# EasyEDA Pro project ProProject_基于STM32的Buck-Boost型数字电源_2024-06-04.epro, board PCB3
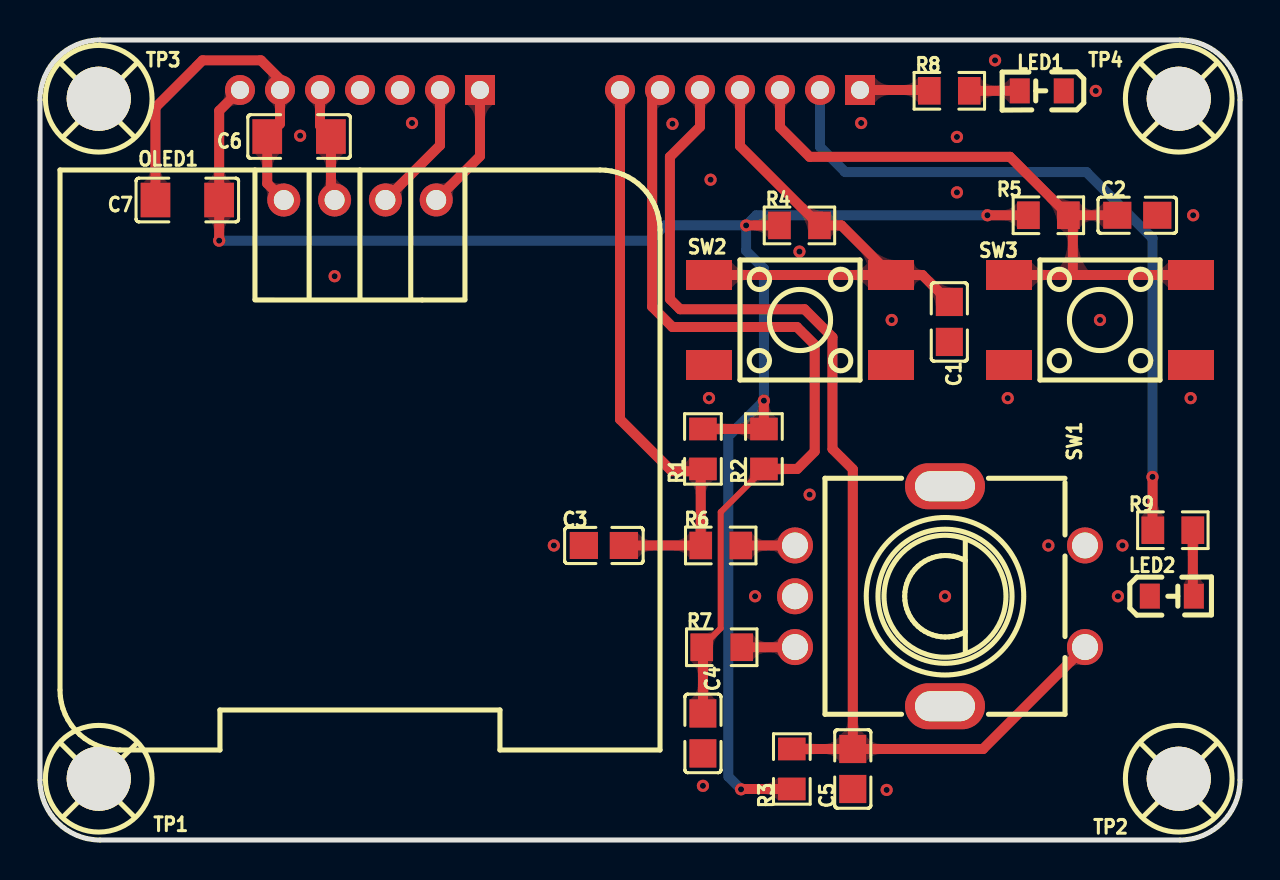
[diagram p11: board, top side]
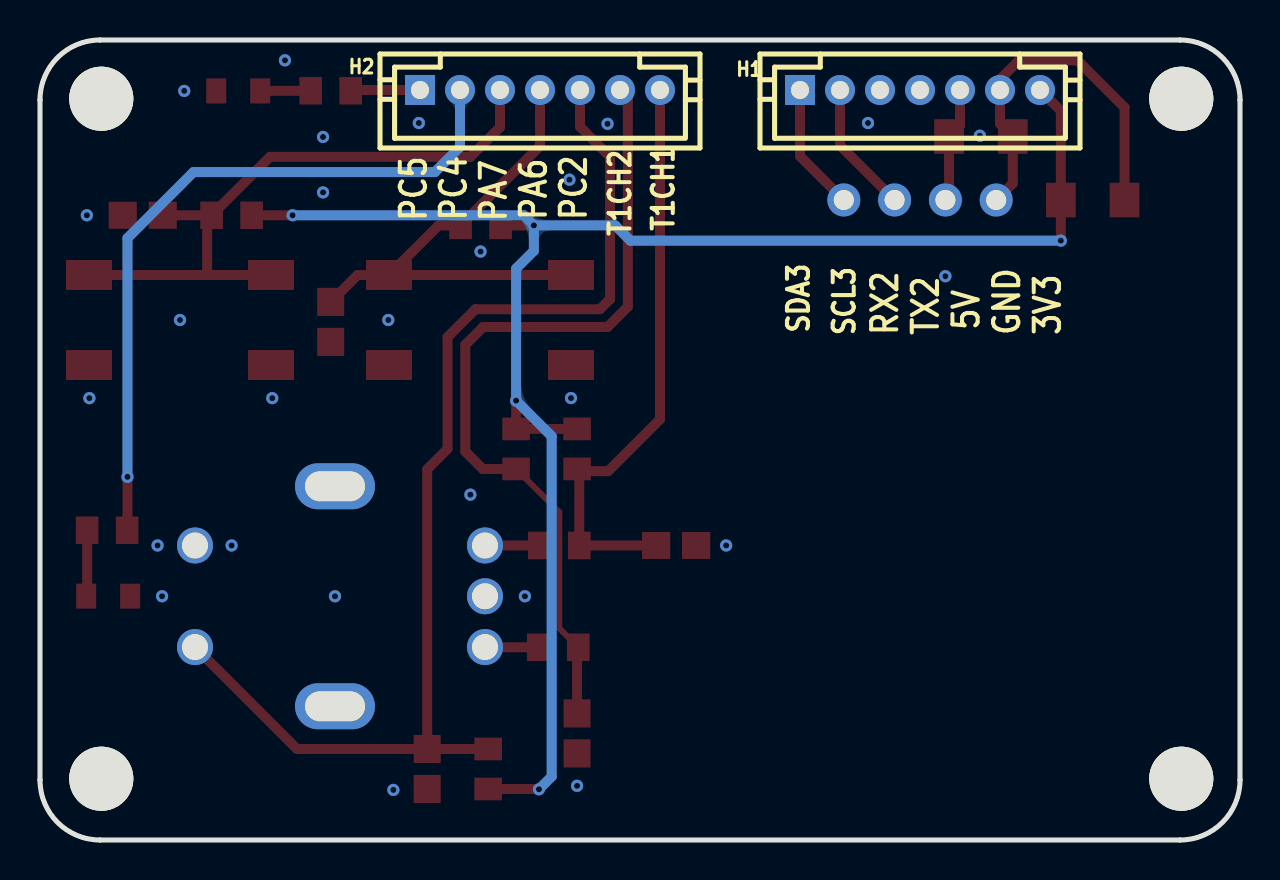
[diagram p12: board, bottom side, seen from below]

Outline 60 x 40 mm; copper layers: Top Layer, Bottom Layer. Coordinates in mm from the lower left corner of the outline.
Outline path: 0,37 0,3 arc(0.88,0.88) 3,0 57,0 arc(59.12,0.88) 60,3 60,37 arc(59.12,39.12) 57,40 3,40 arc(0.88,39.12) 0,37
Stack: Top Layer 0.035mm / Dielectric1 1.51mm FR4 er 4.5 / Bottom Layer 0.035mm

## Design rules (mm)
template: 自定义配置
spacing copperThickness1oz (default): track to track 0.102, other pairs 0.152 to 0.3
spacing copperThickness2oz: track to track 0.203, other pairs 0.152 to 0.3
track width copperThickness1oz (default): min 0.127, default 0.254, max 2.54
track width copperThickness2oz: min 0.203, default 0.254, max 2.54
differential pair differentialPair (default): width min 0.127, default 0.254, max 2.54; gap min 0.152, default 0.152
via viaSize (default): diameter min 0.5, default 0.61, max 10; hole min 0.3, default 0.305, max 6.3

## Placement (name value [footprint] x y rotation side)
C1  100nF  [C0805]  45.47 25.9 270 top
C2  100nF  [C0805]  54.86 31.24 0 top
C3  100nF  [C0805]  28.19 14.73 0 top
C4  100nF  [C0805]  33.15 5.33 90 top
C5  12nF  [C0805]  40.64 3.55 90 top
C6  10uF  [C1206]  12.95 35.17 0 top
C7  10uF  [C1206]  7.37 32 0 top
H1  BX-PH2.0-7PZZ  [CONN-TH_7P-P2.00_BX-PH2.0-7PZZ]  16 37.5 180 bottom
H2  BX-PH2.0-7PZZ  [CONN-TH_7P-P2.00_BX-PH2.0-7PZZ]  35 37.5 180 bottom
LED1  NCD0805R1  [LED_0805]  50.04 37.46 180 top
LED2  NCD0805R1  [LED_0805]  56.64 12.19 0 top
OLED1  HS96L03W2C03  [0.96OLED_4P]  16 32 0 top
R1  10kΩ  [R0805]  33.15 19.55 90 top
R2  10kΩ  [R0805]  36.19 19.55 90 top
R3  10kΩ  [R0805]  37.59 3.55 270 top
R4  10kΩ  [R0805]  37.97 30.73 0 top
R5  10kΩ  [R0805]  50.42 31.24 0 top
R6  330Ω  [R0805]  34.04 14.73 0 top
R7  330Ω  [R0805]  34.09 9.64 0 top
R8  330Ω  [R0805]  45.47 37.46 0 top
R9  330Ω  [R0805]  56.64 15.49 0 top
SW1  EC11E15244G1  [SW-TH_EC11E15244G1]  45 12.19 270 top
SW2  KH-6X6X5H-STM  [SW-SMD_4P-L6.0-W6.0-P4.50-LS9.0-2]  38 26 0 top
SW3  KH-6X6X5H-STM  [SW-SMD_4P-L6.0-W6.0-P4.50-LS9.0-2]  53 26 0 top
TP1  -  [M3螺丝]  3 3 0 top
TP2  -  [M3螺丝]  57 3 0 top
TP3  -  [M3螺丝]  3 37 0 top
TP4  -  [M3螺丝]  57 37 0 top

## Footprints (pads in the part's own frame, mm; a bottom-side part is the same pattern mirrored in y, then rotated)
0.96OLED_4P
  round 1.65 hole 1: 1(-3.81,-0.002) 2(-1.27,0.002) 3(1.27,0.002) 4(3.81,0.002)
C0805
  rect 1.41x1.35 smd: 1(-1,0) 2(1,0)
C1206
  rect 1.485x1.728 smd: 1(-1.593,0) 2(1.593,0)
CONN-TH_7P-P2.00_BX-PH2.0-7PZZ
  rect 1.5x1.5 hole 0.9: 1(-6,0)
  round 1.5 hole 0.9: 2(-4,0) 3(-2,0) 4(0,0) 5(2,0) 6(4,0) 7(6,0)
LED_0805
  rect 1x1.25 smd: 1(-1.15,0.005) 2(1.05,0.005)
M3螺丝
  round 3.2 hole 3.2: 1(-0.064,0.064)
R0805
  rect 1.133x1.377 smd: 1(-1,0) 2(1,0)
SW-SMD_4P-L6.0-W6.0-P4.50-LS9.0-2
  rect 2.3x1.5 smd: 1(-4.55,2.25) 2(4.55,2.25) 3(-4.55,-2.25) 4(4.55,-2.25)
SW-TH_EC11E15244G1
  oval 2.3x4 hole 1.5x3: 6(5.5,0.25) 7(-5.5,0.25)
  round 1.8 hole 1.3: A(-2.54,-7.25) B(2.54,-7.25) C(0,-7.25) D(-2.54,7.25) E(2.54,7.25)

## Nets
GND: C1.2 C2.2 C3.1 C4.1 C5.1 C6.1 C7.1 H1.6 LED1.1 LED2.1 OLED1.1 SW1.6 SW1.7 SW1.C SW1.D SW2.3 SW2.4 SW3.3 SW3.4
P3V3: C7.2 H1.7 R1.2 R2.2 R3.2 R4.1 R5.1
P5V: C6.2 H1.5 OLED1.2
I2C3_SCL: H1.2 OLED1.3
I2C3_SDA: H1.1 OLED1.4
KEY1: C1.1 H2.4 R4.2 SW2.1 SW2.2
KEY2: C2.1 H2.3 R5.2 SW3.1 SW3.2
LED_G: H2.2 R9.1
LED_R: H2.1 R8.1
PC2: C5.2 H2.5 R3.1 SW1.E
TIM1_CH1: C3.2 H2.7 R1.1 R6.1
TIM1_CH2: C4.2 H2.6 R2.1 R7.1
UART2_RX: H1.3
UART2_TX: H1.4
$1N356: R6.2 SW1.A
$1N357: R7.2 SW1.B
$1N559: LED1.2 R8.2
$1N563: LED2.2 R9.2

Pads without a net: TP1 1; TP2 1; TP3 1; TP4 1

## Via types
v1: diameter 0.61, hole 0.305, Top Layer to Bottom Layer, 32 vias

## Routing (per net, layer and track width the routed paths; a pad name or vN(x,y) marks a point on that pad's centre or on a via; arc(x,y) is an arc through that point)
GND: length 18.9
  Top Layer w0.5: C7.1 5.77,36.63 8.13,38.98 11.05,38.98 12,38.03 H1.6 12,35.81 C6.1 11.36,32.83 OLED1.1
  vias: v1(13.01,35.21) v1(14.73,28.19) v1(18.6,35.85) v1(25.69,14.73) v1(31.62,35.81) v1(33.15,2.71) v1(33.45,22.1) v1(33.53,33.02) v1(35.75,12.19) v1(37.97,29.42) v1(38.48,17.27) v1(41.06,35.85) v1(42.33,2.5) v1(42.59,26) v1(45.25,12.19) v1(45.85,35.15) v1(45.85,32.38) v1(47.75,38.98) v1(48.39,22.09) v1(50.42,14.73) v1(52.79,37.45) v1(53,26) v1(53.9,12.19) v1(54.12,14.73) v1(57.53,22.09) v1(57.66,31.24)
P3V3: length 87.2
  Top Layer w0.5: H1.7 8.96,36.46 C7.2 v1(8.96,29.97) ; v1(35.05,2.53) 35.07,2.55 R3.2 ; v1(35.31,30.73) R4.1 ; v1(36.19,21.97) R2.2 R1.2 ; R5.1 v1(47.37,31.24)
  Bottom Layer w0.5: v1(8.96,29.97) 30.48,29.97 31.24,30.73 v1(35.31,30.73) ; v1(35.31,30.73) 35.31,29.46 36.19,28.57 v1(36.19,21.97) 34.42,20.19 34.42,3.17 v1(35.05,2.53) ; v1(35.31,30.73) 35.81,31.24 v1(47.37,31.24)
P5V: length 5.8
  Top Layer w0.5: OLED1.2 14.55,32.18 C6.2 14,35.72 H1.5
I2C3_SCL: length 6.6
  Top Layer w0.5: H1.2 20,34.73 OLED1.3
I2C3_SDA: length 6.4
  Top Layer w0.5: H1.1 22,34.19 OLED1.4
KEY1: length 25.6
  Top Layer w0.5: SW2.2 40.07,30.73 R4.2 35,34.7 H2.4 ; SW2.2 SW2.1 ; SW2.2 44.12,28.25 C1.1
KEY2: length 32.6
  Top Layer w0.5: 51.64,28.25 SW3.2 ; 51.64,28.25 51.64,31.01 ; 51.64,28.25 SW3.1 ; 51.64,31.01 51.87,31.24 C2.1 ; 51.64,31.01 R5.2 48.5,34.16 38.48,34.16 37,35.64 H2.3
LED_G: length 36
  Top Layer w0.5: v1(55.63,18.16) 55.63,15.5 R9.1
  Bottom Layer w0.5: H2.2 39,34.66 40.26,33.4 52.32,33.4 55.63,30.09 v1(55.63,18.16)
LED_R: length 3.5
  Top Layer w0.5: R8.1 44.43,37.5 H2.1
PC2: length 57.8
  Top Layer w0.5: R3.1 C5.2 ; C5.2 40.64,18.54 39.62,19.55 39.62,25.14 38.23,26.54 32,26.54 31.5,27.05 31.5,34.16 33,35.66 H2.5 ; C5.2 47.15,4.55 52.25,9.65
TIM1_CH1: length 29.3
  Top Layer w0.5: H2.7 29,21.03 31.59,18.44 33.04,18.44 ; C3.2 R6.1 33.04,18.44 ; 33.04,18.44 R1.1
TIM1_CH2: length 41.7
  Top Layer w0.3: R2.1 34.04,16.39 34.04,10.59 R7.1
  Top Layer w0.5: H2.6 30.61,37.11 30.61,26.67 31.62,25.65 37.85,25.65 38.74,24.76 38.74,19.43 37.86,18.55 R2.1 ; R7.1 33.15,9.58 C4.2
$1N356: length 2.7
  Top Layer w0.5: R6.2 SW1.A
$1N357: length 2.7
  Top Layer w0.5: 37.75,9.65 37.74,9.64 R7.2
$1N559: length 2.5
  Top Layer w0.5: LED1.2 48.98,37.46 R8.2
$1N563: length 3.3
  Top Layer w0.5: R9.2 57.64,12.24 LED2.2

## Copper pours and planes (outline as drawn; the poured copper is in the pictures)
GND on Top Layer: -0.51,40.38 60.45,40.38 60.45,-0.39 -0.51,-0.39
GND on Bottom Layer: -2.67,42.41 62.36,42.41 62.36,-3.05 -2.67,-3.05

Small or netless copper shapes (teardrops, artwork), in the pictures only: 67 on Top Layer, 3 on Bottom Layer

## Text on the board
Bottom Silkscreen Layer: SCL3 | SDA3 | T1CH1 | T1CH2 | 3V3 | GND | 5V | TX2 | RX2 | PC2 | PA6 | PA7 | PC4 | PC5
